# Altium project test.PrjPcb
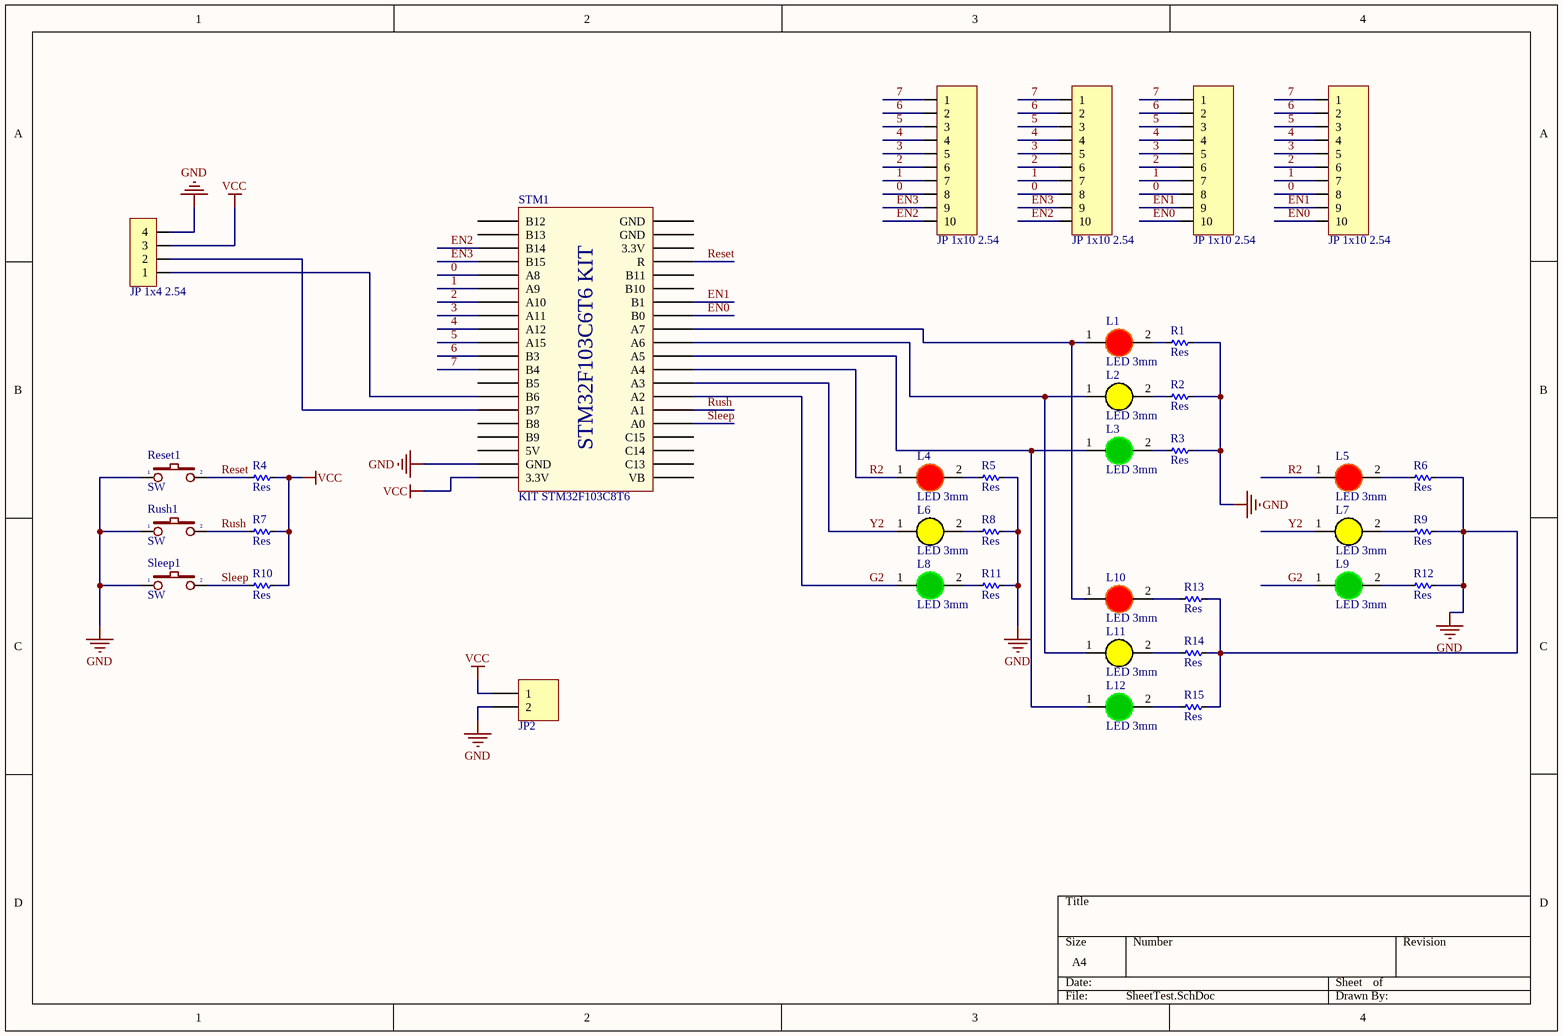
[diagram p0: SheetTest.SchDoc]
1 sheet, 37 parts. Net scope: global (net labels, ports and power ports of the same name join across sheets).
Board file: PCBTest.PcbDoc

## Sheet SheetTest.SchDoc
size A4

### Parts
JP1  JP 1x4 2.54  [JP 1x4 DT]
JP2  Header 2_1  [HED2]  (value not drawn)
L1  LED 3mm  [LED-3MM-RED]
L2  LED 3mm  [LED-3MM-YELLOW]
L3  LED 3mm  [LED-3MM-GREEN]
L4  LED 3mm  [LED-3MM-RED]
L5  LED 3mm  [LED-3MM-RED]
L6  LED 3mm  [LED-3MM-YELLOW]
L7  LED 3mm  [LED-3MM-YELLOW]
L8  LED 3mm  [LED-3MM-GREEN]
L9  LED 3mm  [LED-3MM-GREEN]
L10  LED 3mm  [LED-3MM-RED]
L11  LED 3mm  [LED-3MM-YELLOW]
L12  LED 3mm  [LED-3MM-GREEN]
Led1  JP 1x10 2.54  [JP 1x10 DT]
Led2  JP 1x10 2.54  [JP 1x10 DT]
Led3  JP 1x10 2.54  [JP 1x10 DT]
Led4  JP 1x10 2.54  [JP 1x10 DT]
R1  Res  [RES-1/2W]
R2  Res  [RES-1/2W]
R3  Res  [RES-1/2W]
R4  Res  [RES-1/2W]
R5  Res  [RES-1/2W]
R6  Res  [RES-1/2W]
R7  Res  [RES-1/2W]
R8  Res  [RES-1/2W]
R9  Res  [RES-1/2W]
R10  Res  [RES-1/2W]
R11  Res  [RES-1/2W]
R12  Res  [RES-1/2W]
R13  Res  [RES-1/2W]
R14  Res  [RES-1/2W]
R15  Res  [RES-1/2W]
Reset1  SW  [SW2]
Rush1  SW  [SW2]
Sleep1  SW  [SW2]
STM1  KIT STM32F103C8T6  [STM32F103 KIT]

### Nets
GND: JP1.4 JP2.2 R1.1 R2.1 R3.1 R5.1 R6.1 R8.1 R9.1 R11.1 R12.1 R13.1 R14.1 R15.1 Reset1.1 Rush1.1 Sleep1.1 STM1.19(GND)
VCC: JP1.3 JP2.1 R4.1 R7.1 R10.1 STM1.20(3.3V)
0: Led1.8 Led2.8 Led3.8 Led4.8 STM1.5(A8)
1: Led1.7 Led2.7 Led3.7 Led4.7 STM1.6(A9)
2: Led1.6 Led2.6 Led3.6 Led4.6 STM1.7(A10)
3: Led1.5 Led2.5 Led3.5 Led4.5 STM1.8(A11)
4: Led1.4 Led2.4 Led3.4 Led4.4 STM1.9(A12)
5: Led1.3 Led2.3 Led3.3 Led4.3 STM1.10(A15)
6: Led1.2 Led2.2 Led3.2 Led4.2 STM1.11(B3)
7: Led1.1 Led2.1 Led3.1 Led4.1 STM1.12(B4)
EN0: Led3.10 Led4.10 STM1.33(B0)
EN1: Led3.9 Led4.9 STM1.34(B1)
EN2: Led1.10 Led2.10 STM1.3(B14)
EN3: Led1.9 Led2.9 STM1.4(B15)
G2: L8.1(A) L9.1(A) STM1.27(A2)
R2: L4.1(A) L5.1(A) STM1.29(A4)
Reset: R4.2 Reset1.2 STM1.37(R)
Rush: R7.2 Rush1.2 STM1.26(A1)
Sleep: R10.2 Sleep1.2 STM1.25(A0)
Y2: L6.1(A) L7.1(A) STM1.28(A3)
NetJP1_1: JP1.1 STM1.14(B6)
NetJP1_2: JP1.2 STM1.15(B7)
NetL1_1: L1.1(A) L10.1(A) STM1.32(A7)
NetL1_2: L1.2(K) R1.2
NetL2_1: L2.1(A) L11.1(A) STM1.31(A6)
NetL2_2: L2.2(K) R2.2
NetL3_1: L3.1(A) L12.1(A) STM1.30(A5)
NetL3_2: L3.2(K) R3.2
NetL4_2: L4.2(K) R5.2
NetL5_2: L5.2(K) R6.2
NetL6_2: L6.2(K) R8.2
NetL7_2: L7.2(K) R9.2
NetL8_2: L8.2(K) R11.2
NetL9_2: L9.2(K) R12.2
NetL10_2: L10.2(K) R13.2
NetL11_2: L11.2(K) R14.2
NetL12_2: L12.2(K) R15.2

Not connected (* = marked no-connect by the designer): STM1 1(B12) 2(B13) 13(B5) 16(B8) 17(B9) 18(5V) 21(VB) 22(C13) 23(C14) 24(C15) 35(B10) 36(B11) 38(3.3V) 39(GND) 40(GND)

### Notes on the sheet
- (in symbol STM32f103 Bluepill) STM32F103C6T6 KIT

### Library data of the parts
JP1 = JP 1x4 2.54 Duc Thang: Cắm; Ten_Linh_Kien: Jump Đơn Đực 2.54MM 1x40P Thẳng 11MM; Don_Vi: Con; Ma_Hang: MH000903; Ghi_Chu: *; Kieu_Chan: *; Chung_Loai: Cắm
JP2 = Header 2_1: Header, 2-Pin; Manufacturer: Generic Components; Class: Connector; Value: Header 2
L1 L4 L5 L10 = LED 3mm Do: Cắm; Don_Vi: Con; Ma_Hang: MH003892; Ten_Linh_Kien: Led 3MM Phủ Đỏ (10c); Ghi_Chu: *; Kieu_Chan: *; Chung_Loai: Cắm
L2 L6 L7 L11 = LED 3mm Vang: Cắm; Don_Vi: Con; Ma_Hang: MH003893; Ten_Linh_Kien: Led 3MM Phủ Vàng (10c); Ghi_Chu: *; Kieu_Chan: *; Chung_Loai: Cắm
L3 L8 L9 L12 = LED 3mm Xanh La: Cắm; Don_Vi: Con; Ma_Hang: MH001054; Ten_Linh_Kien: Led 3MM Phủ Xanh (10c); Ghi_Chu: *; Kieu_Chan: *; Chung_Loai: Cắm
Led1-Led4 = JP 1x10 2.54 Duc Thang: Cắm; Ten_Linh_Kien: Jump Đơn Đực 2.54MM 1x40P Thẳng 11MM; Don_Vi: Con; Ma_Hang: MH000903; Ghi_Chu: *; Kieu_Chan: *; Chung_Loai: Cắm
R1-R15 = Res: Manufacturer: Generic Components; Class: Passive; SubClass: R; Published: 08/06/2000; Publisher: Altium Hobart Technology Centre
Reset1 Rush1 Sleep1 = SW2: Switch button 2 pin; Value: SW chip 2 pin
STM1 = STM32f103 Bluepill: KIT STM32F103C8T6 Bluepill